# Altium project epsv2.PrjPCB
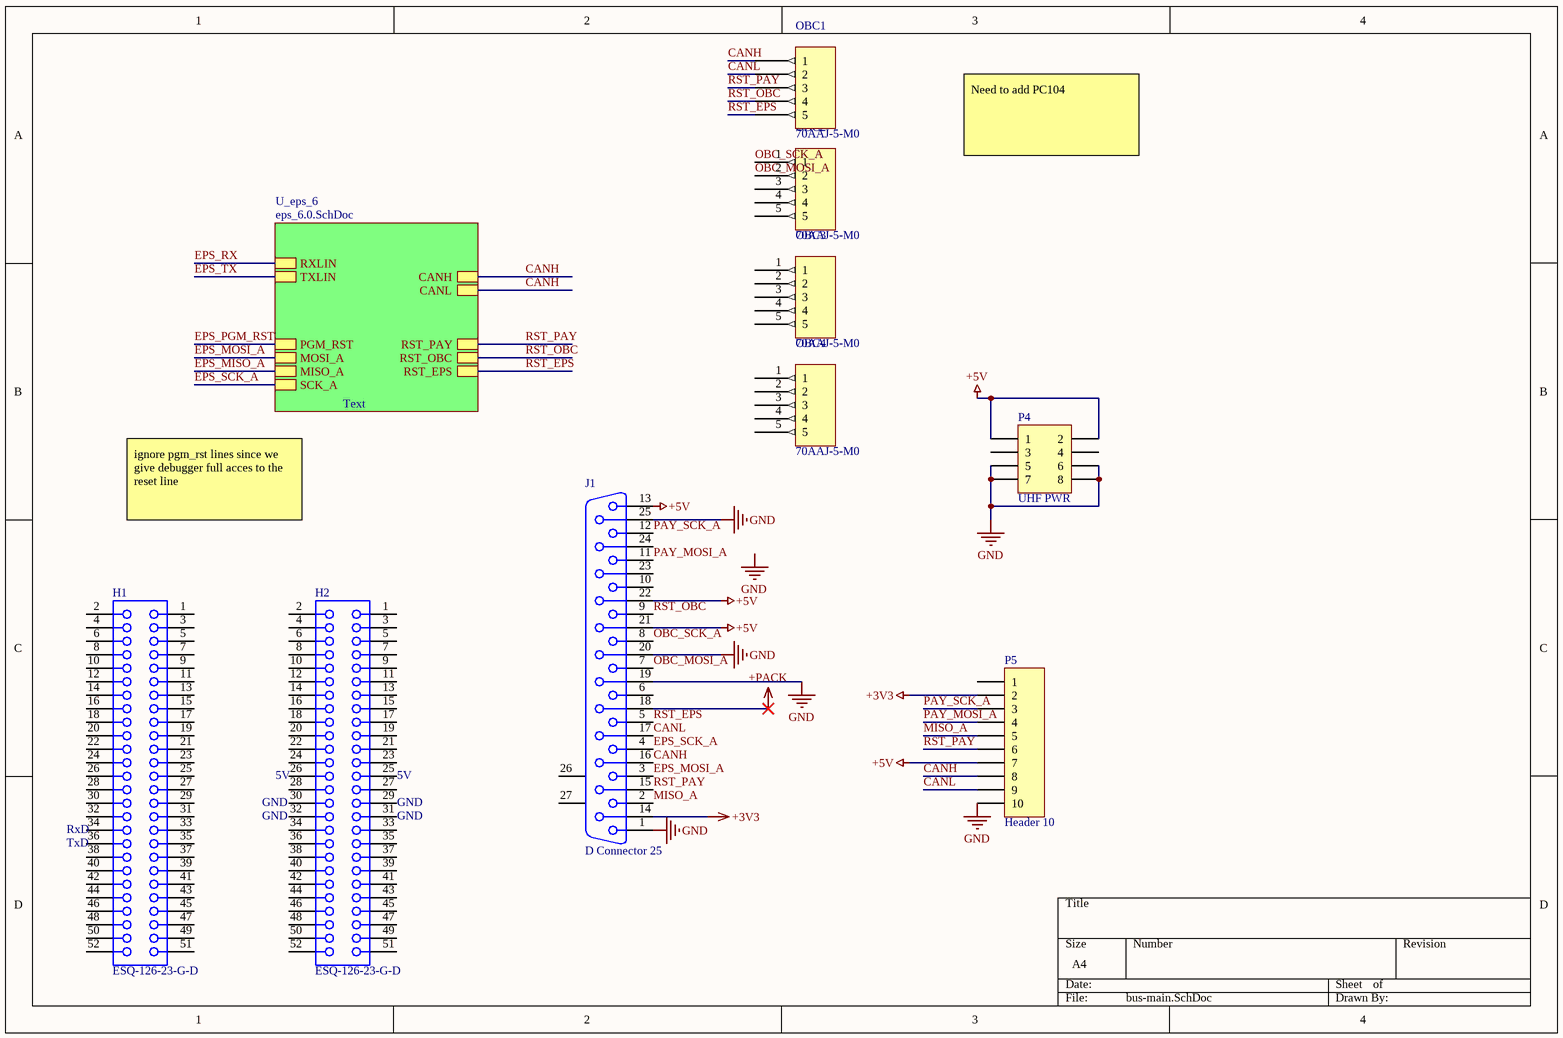
[diagram p0: bus-main.SchDoc]
5 sheets, 64 parts. Net scope: hierarchical (ports join the sheet entries above them; power ports are global).
Board file: eps.PcbDoc
Sheets:
  bus-main.SchDoc
    U_eps_6 = eps_6.0.SchDoc
      U_eps_bt11 = eps_bt1.SchDoc
      U_eps_bt12 = eps_bt1.SchDoc
      U_eps_batt = eps_batt.SchDoc
      Designator = bt_current_monitor.SchDoc

## Sheet bus-main.SchDoc
size A4

### Parts
H1  ESQ-126-23-G-D  [SMTC-ESQ-126-23-X-D]
H2  ESQ-126-23-G-D  [SMTC-ESQ-126-23-X-D]
J1  D Connector 25  [Mini DSub Connector]
OBC1  70AAJ-5-M0
OBC2  70AAJ-5-M0
OBC3  70AAJ-5-M0
OBC4  70AAJ-5-M0
P4  UHF PWR  [HDR2X4]
P5  Header 10  [DF14-10P-1.25H(55) - duplicate]

### Sub-sheets
U_eps_6 = eps_6.0.SchDoc: RXLIN, TXLIN, RST_PAY, RST_OBC, RST_EPS, SCK_A, PGM_RST, MOSI_A, MISO_A, CANL, CANH

### Nets
+3V3: J1.14 P5.2
+5V: J1.13 J1.21 J1.22 P4.1 P4.2 P5.7
+PACK: J1.18
GND: J1.1 J1.19 J1.20 J1.25 P4.5 P4.6 P4.7 P4.8 P5.10
CANH: J1.16 OBC1.1 P5.8 ; sheet U_eps_6/CANL, sheet U_eps_6/CANH
CANL: J1.17 OBC1.2 P5.9
EPS_MISO_A: sheet U_eps_6/MISO_A
EPS_MOSI_A: J1.3 ; sheet U_eps_6/MOSI_A
EPS_PGM_RST: sheet U_eps_6/PGM_RST
EPS_RX: sheet U_eps_6/RXLIN
EPS_SCK_A: J1.4 ; sheet U_eps_6/SCK_A
EPS_TX: sheet U_eps_6/TXLIN
MISO_A: J1.2 P5.5
OBC_MOSI_A: J1.7 OBC2.2
OBC_SCK_A: J1.8 OBC2.1
PAY_MOSI_A: J1.11 P5.4
PAY_SCK_A: J1.12 P5.3
RST_EPS: J1.5 OBC1.5 ; sheet U_eps_6/RST_EPS
RST_OBC: J1.9 OBC1.4 ; sheet U_eps_6/RST_OBC
RST_PAY: J1.15 OBC1.3 P5.6 ; sheet U_eps_6/RST_PAY

Not connected (* = marked no-connect by the designer): H1 1 2 3 4 5 6 7 8 9 10 11 12 13 14 15 16 17 18 19 20 21 22 23 24 25 26 27 28 29 30 31 32 33 34 35 36 37 38 39 40 41 42 43 44 45 46 47 48 49 50 51 52; H2 1 2 3 4 5 6 7 8 9 10 11 12 13 14 15 16 17 18 19 20 21 22 23 24 25 26 27 28 29 30 31 32 33 34 35 36 37 38 39 40 41 42 43 44 45 46 47 48 49 50 51 52; J1 6 10 23 24 26(MH1) 27(MH2); OBC2 3 4 5; OBC3 1 2 3 4 5; OBC4 1 2 3 4 5; P4 3 4; P5 1

### Notes on the sheet
- Need to add PC104
- Text
- ignore pgm_rst lines since we give debugger full acces to the reset line
- (near H2) 5V
- (near H1) RxD
- (near H1) TxD
- (near H2) GND
- Labels drawn without touching a wire or pin: GND

### Library data of the parts
H1 H2 = ESQ-126-23-G-D: PC/104(TM) Elevated Socket Strip, Through-hole, Vertical, -55 to 125 degC, 2.54 mm Pitch, 52-Pin, Female, RoHS; Manufacturer: Samtec; Pitch: 2.54 mm; DatasheetVersion: F-214; PackageVersion: BZ, 9/1998; PackageReference: ESQ-126-23-X-D; PackageDescription: ESQ Strip ASM; Supplier 1: Newark; Supplier Part Number 1: 92P1348; Orientation: Vertical; RoHS: True; Temperature Range: -55 to 125 degC; Mounting Technology: Through-hole; PartNumber: ESQ-126-23-G-D; ComponentLink1Description: Manufacturer URL; ComponentLink1URL: http://www.samtec.com; ComponentLink2Description: Datasheet; ComponentLink2URL: http://www.samtec.com/documents/webfiles/pdf/ESQ_TH.PDF; ComponentLink3Description: Package Specification; ComponentLink3URL: http://www.samtec.com/documents/webfiles/cpdf/ESQ-1XX-XX-X-X-XXX-XX-X-XX-MKT.pdf
J1 = D Connector 25: Receptacle Assembly, 25 Position, Right Angle; PackageDocument: U; Positions: 25; Published: 15-Jun-2001; LatestRevisionDate: 17-Jul-2002; LatestRevisionNote: Re-released for DXP Platform.; DatasheetDocument: 19-Mar-1999; PackageReference: 787202; Publisher: Altium Limited; Orientation: Right Angle; Gender: Receptacle; ComponentLink1Description: Mini-D25 - Molex, LLC 0836149012; ComponentLink1URL: https://www.digikey.ca/product-detail/en/molex-llc/0836149012/WM2144-ND/1867000
P4 = Header 4X2: Header, 4-Pin, Dual row; LatestRevisionDate: 17-Jul-2002; LatestRevisionNote: Re-released for DXP Platform.; Publisher: Altium Limited
P5 = Header 10: Header, 10-Pin; LatestRevisionDate: 17-Jul-2002; LatestRevisionNote: Re-released for DXP Platform.; Publisher: Altium Limited

## Sheet eps_6.0.SchDoc
size A
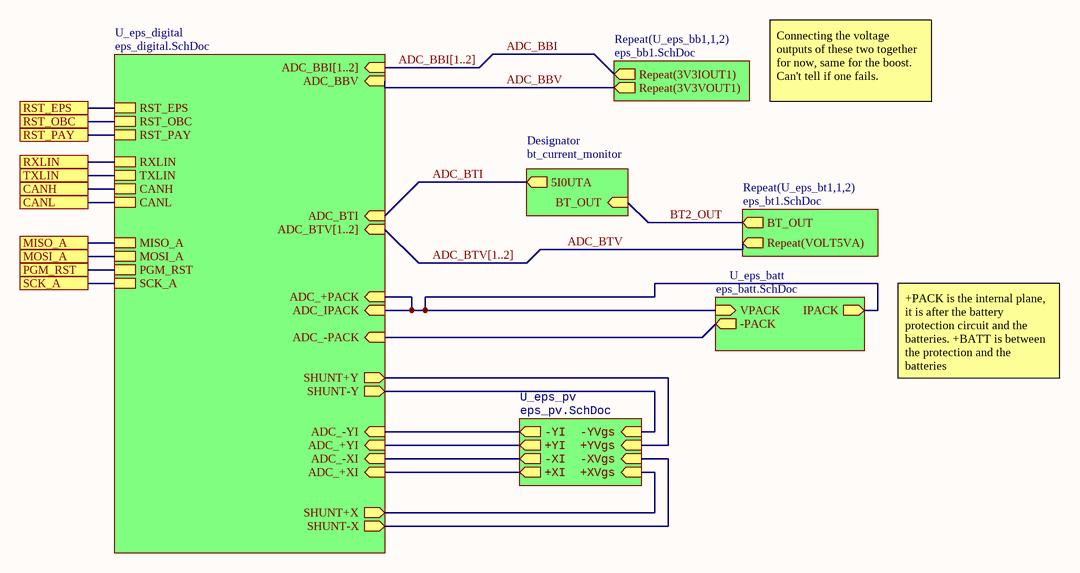
[diagram p1: eps_6.0.SchDoc]

### Sub-sheets
Designator = bt_current_monitor: 5I0UTA (out), BT_OUT (in)
Repeat(U_eps_bb1,1,2) = eps_bb1.SchDoc (file not in this document): Repeat(3V3IOUT1) (out), Repeat(3V3VOUT1) (out)
Repeat(U_eps_bt1,1,2) = eps_bt1.SchDoc: Repeat(VOLT5VA) (out), BT_OUT (out)
U_eps_batt = eps_batt.SchDoc: IPACK (out), VPACK (in), -PACK (out)
U_eps_digital = eps_digital.SchDoc (file not in this document): RST_EPS, RST_OBC, RST_PAY, RXLIN, TXLIN, CANH, CANL, MISO_A, MOSI_A, PGM_RST, SCK_A, ADC_BTV[1..2] (in), ADC_BTI (in), ADC_-PACK (in), ADC_BBI[1..2] (in), ADC_+XI (in), ADC_-XI (in), ADC_+YI (in), ADC_+PACK (in), ADC_-YI (in), SHUNT-Y (out), SHUNT+Y (out), ADC_BBV (in), SHUNT-X (out), SHUNT+X (out), ADC_IPACK (in)
U_eps_pv = eps_pv.SchDoc (file not in this document): +YI (out), -YI (out), -YVgs (in), +XI (out), +YVgs (in), +XVgs (in), -XVgs (in), -XI (out)

### Ports
CANH, CANL, MISO_A, MOSI_A, PGM_RST, RST_EPS, RST_OBC, RST_PAY, RXLIN, SCK_A, TXLIN

### Nets
-PACK: sheet U_eps_digital/ADC_-PACK, sheet U_eps_batt/-PACK
ADC_BBI: sheet Repeat(U_eps_bb1,1,2)/Repeat(3V3IOUT1)
ADC_BBV: sheet U_eps_digital/ADC_BBV, sheet Repeat(U_eps_bb1,1,2)/Repeat(3V3VOUT1)
ADC_BTI: sheet U_eps_digital/ADC_BTI, sheet Designator/5I0UTA
ADC_BTV: sheet Repeat(U_eps_bt1,1,2)/Repeat(VOLT5VA)
BT2_OUT: sheet Repeat(U_eps_bt1,1,2)/BT_OUT, sheet Designator/BT_OUT
CANH: port CANH, port CANL, sheet U_eps_digital/CANH, sheet U_eps_digital/CANL
EPS_MISO_A: port MISO_A, sheet U_eps_digital/MISO_A
EPS_MOSI_A: port MOSI_A, sheet U_eps_digital/MOSI_A
EPS_PGM_RST: port PGM_RST, sheet U_eps_digital/PGM_RST
EPS_RX: port RXLIN, sheet U_eps_digital/RXLIN
EPS_SCK_A: port SCK_A, sheet U_eps_digital/SCK_A
EPS_TX: port TXLIN, sheet U_eps_digital/TXLIN
IPACK: sheet U_eps_digital/ADC_+PACK, sheet U_eps_digital/ADC_IPACK, sheet U_eps_batt/IPACK, sheet U_eps_batt/VPACK
RST_EPS: port RST_EPS, sheet U_eps_digital/RST_EPS
RST_OBC: port RST_OBC, sheet U_eps_digital/RST_OBC
RST_PAY: port RST_PAY, sheet U_eps_digital/RST_PAY
(unnamed): sheet U_eps_digital/ADC_+XI, sheet U_eps_pv/+XI
(unnamed): sheet U_eps_digital/ADC_-XI, sheet U_eps_pv/-XI
(unnamed): sheet U_eps_digital/ADC_+YI, sheet U_eps_pv/+YI
(unnamed): sheet U_eps_digital/ADC_-YI, sheet U_eps_pv/-YI
(unnamed): sheet U_eps_digital/SHUNT-Y, sheet U_eps_pv/-YVgs
(unnamed): sheet U_eps_digital/SHUNT+Y, sheet U_eps_pv/+YVgs
(unnamed): sheet U_eps_digital/SHUNT-X, sheet U_eps_pv/-XVgs
(unnamed): sheet U_eps_digital/SHUNT+X, sheet U_eps_pv/+XVgs

### Buses and harness runs
bus ADC_BBI[1..2] = sheet U_eps_digital/ADC_BBI[1..2]
bus ADC_BTV[1..2] = sheet U_eps_digital/ADC_BTV[1..2]

### Notes on the sheet
- Connecting the voltage outputs of these two together for now, same for the boost. Can't tell if one fails.
- +PACK is the internal plane, it is after the battery protection circuit and the batteries. +BATT is between the protection and the batteries

## Sheet eps_bt1.SchDoc
size A
Used 2 times, as channels U_eps_6/U_eps_bt11, U_eps_6/U_eps_bt12. Parts and nets are listed once, with the designators drawn on the sheet.
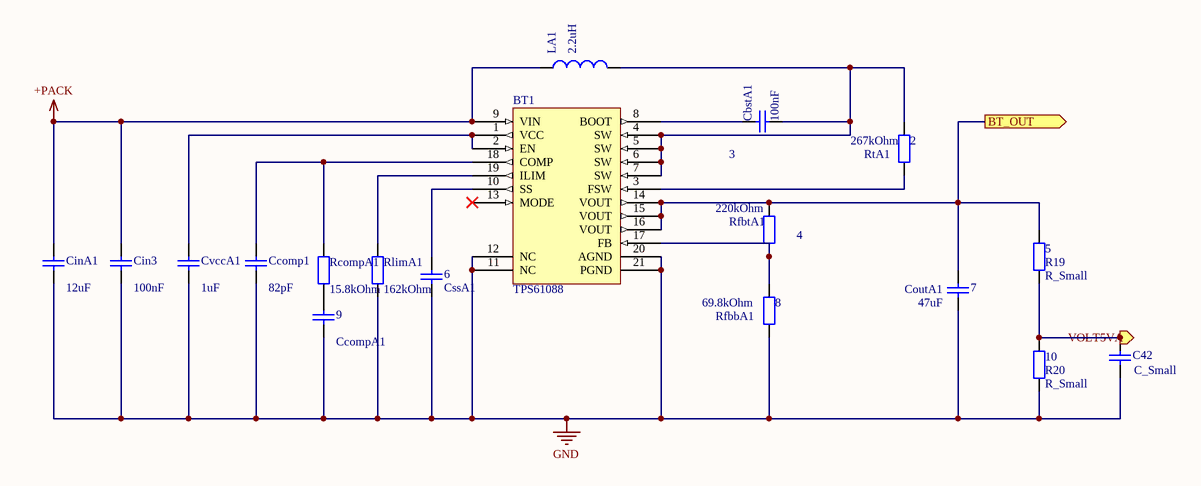
[diagram p2: eps_bt1.SchDoc]

### Parts
2  RtA1  value 267kOhm  [1608[0603]]
3  CbstA1  value 100nF  [1608[0603]]
4  RfbtA1  value 220kOhm  [1608[0603]]
5  R19  value R_Small  [1608[0603]]
6  CssA1  [1608[0603]]
7  CoutA1  value 47uF  [1608[0603]]
8  RfbbA1  value 69.8kOhm  [1608[0603]]
9  value CcompA1  [1608[0603]]
10  R20  value R_Small  [1608[0603]]
BT1  TPS61088  [QFN50P450X350X100-21N]
C42  value C_Small  [1608[0603]]
Ccomp1  value 82pF  [1608[0603]]
Cin3  value 100nF  [1608[0603]]
CinA1  value 12uF  [1608[0603]]
CvccA1  value 1uF  [1608[0603]]
LA1  value 2.2uH  [1608[0603]]
RcompA1  value 15.8kOhm  [1608[0603]]
RlimA1  value 162kOhm  [1608[0603]]

### Ports
BT_OUT (out), VOLT5VA (out)

### Nets
+PACK: BT1.9(VIN) Cin3.2 CinA1.2 LA1.1
GND: 6.1 7.1 8.1 9.1 10.1 BT1.11(NC) BT1.12(NC) BT1.20(AGND) BT1.21(PGND) C42.2 Ccomp1.1 Cin3.1 CinA1.1 CvccA1.1 RlimA1.1
BT_OUT: 4.2 5.2 7.2 BT1.14(VOUT) BT1.15(VOUT) BT1.16(VOUT) ; port BT_OUT
VOLT5VA: 5.1 10.2 C42.1 ; port VOLT5VA
Net2_1: 2.1 3.1 BT1.4(SW) BT1.5(SW) BT1.6(SW) BT1.7(SW) LA1.2
Net2_2: 2.2 BT1.3(FSW)
Net3_2: 3.2 BT1.8(BOOT)
Net4_1: 4.1 8.2 BT1.17(FB)
Net6_2: 6.2 BT1.10(SS)
Net9_2: 9.2 RcompA1.1
NetBT1_1: BT1.1(VCC) BT1.2(EN) CvccA1.2
NetBT1_18: BT1.18(COMP) Ccomp1.2 RcompA1.2
NetBT1_19: BT1.19(ILIM) RlimA1.2

Not connected (* = marked no-connect by the designer): BT1 13(MODE)*

### Channels
U_eps_6/U_eps_bt11: designators end in _U_eps_bt11; ports BT_OUT=BT2_OUT VOLT5VA=ADC_BTV1
U_eps_6/U_eps_bt12: designators end in _U_eps_bt12; ports BT_OUT=BT2_OUT VOLT5VA=ADC_BTV2

### Library data of the parts
2 4 5 8 10 RcompA1 RlimA1 = Res2: Resistor; Published: 8-Jun-2000; LatestRevisionDate: 17-Jul-2002; LatestRevisionNote: Re-released for DXP Platform.; PackageReference: AXIAL-0.4; Publisher: Altium Limited; PackageDescription: Axial Device, Thru-Hole; 2 Leads; 0.4 in Pin Spacing
3 6 7 9 C42 Ccomp1 Cin3 CinA1 CvccA1 = Cap: Capacitor; Published: 8-Jun-2000; LatestRevisionDate: 17-Jul-2002; LatestRevisionNote: Re-released for DXP Platform.; PackageReference: RAD-0.3; Publisher: Altium Limited; PackageDescription: Radial Cap, Thru-Hole; 2 Leads; 0.3 in Pin Spacing
BT1 = TPS61088: Boost converter
LA1 = Inductor: Code_IEC: 1005; Published: 8-Jun-2000; LatestRevisionDate: 29-May-2009; LatestRevisionNote: IPC-7351 Footprint Added.; PackageReference: 0402-A; Publisher: Altium Limited; PackageDescription: Chip Inductor; Code_JEITA: 0402

## Sheet eps_batt.SchDoc
size A4
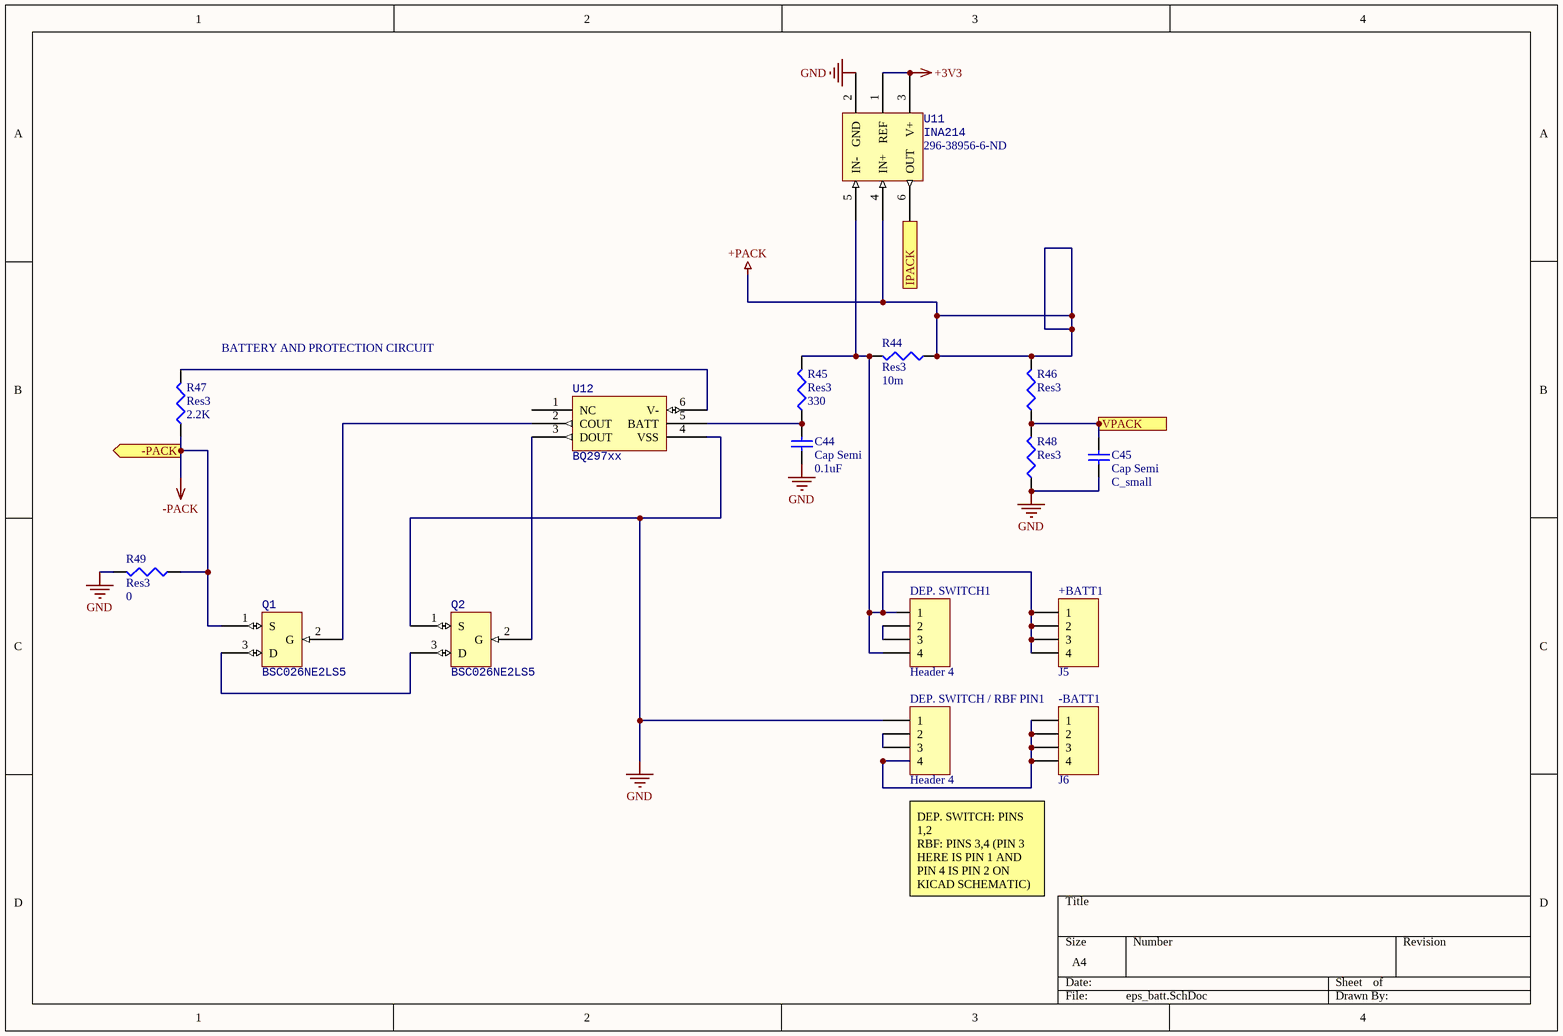
[diagram p3: eps_batt.SchDoc]

### Parts
+BATT1  J5  [DF14-4P-1.25H(55)]
-BATT1  J6  [DF14-4P-1.25H(55)]
C44  Cap Semi  value 0.1uF  [1608[0603]]
C45  Cap Semi  value C_small  [1608[0603]]
DEP._SWITCH1  Header 4  [DF14-4P-1.25H(55)]
DEP._SWITCH_/_RBF_PIN1  Header 4  [DF14-4P-1.25H(55)]
Q1  BSC026NE2LS5  [INF-PG-TDSON-8-1_V]
Q2  BSC026NE2LS5  [INF-PG-TDSON-8-1_V]
R44  Res3  value 10m  [J1-0603]
R45  Res3  value 330  [J1-0603]
R46  Res3  [J1-0603]
R47  Res3  value 2.2K  [J1-0603]
R48  Res3  [J1-0603]
R49  Res3  value 0  [J1-0603]
U11  INA214  Supplier Part Number 1: 296-38956-6-ND  [SOT65P210X110-6N]
U12  BQ297xx  [SON50P150X150X80-6N - duplicate1]

### Ports
-PACK (out), IPACK (out), VPACK (in)

### Nets
+3V3: U11.1(REF) U11.3(V+)
+PACK: R44.1 R46.2 U11.4(IN+)
-PACK: Q1.1(S) R47.1 R49.1 ; port -PACK
GND: C44.1 C45.1 DEP._SWITCH_/_RBF_PIN1.1 Q2.1(S) R48.1 R49.2 U11.2(GND) U12.4(VSS)
IPACK: C45.2 R46.1 R48.2 U11.6(OUT) ; port IPACK, port VPACK
Net+BATT1_1: +BATT1.1 +BATT1.2 +BATT1.3 +BATT1.4 DEP._SWITCH1.1 DEP._SWITCH1.4 R44.2 R45.2 U11.5(IN-)
Net-BATT1_1: -BATT1.1 -BATT1.2 -BATT1.3 -BATT1.4 DEP._SWITCH_/_RBF_PIN1.4
NetC44_2: C44.2 R45.1 U12.5(BATT)
NetDEP._SWITCH1_2: DEP._SWITCH1.2 DEP._SWITCH1.3
NetDEP._SWITCH_/_RBF_PIN1_2: DEP._SWITCH_/_RBF_PIN1.2 DEP._SWITCH_/_RBF_PIN1.3
NetQ1_2: Q1.2(G) U12.2(COUT)
NetQ1_3: Q1.3(D) Q2.3(D)
NetQ2_2: Q2.2(G) U12.3(DOUT)
NetR47_2: R47.2 U12.6(V-)

Not connected (* = marked no-connect by the designer): U12 1(NC)

### Notes on the sheet
- (near R47) BATTERY AND PROTECTION CIRCUIT
- DEP. SWITCH: PINS 1,2
  RBF: PINS 3,4 (PIN 3 HERE IS PIN 1 AND PIN 4 IS PIN 2 ON KICAD SCHEMATIC)

### Library data of the parts
+BATT1 -BATT1 DEP._SWITCH1 DEP._SWITCH_/_RBF_PIN1 = Header 4: Header, 4-Pin; LatestRevisionDate: 17-Jul-2002; LatestRevisionNote: Re-released for DXP Platform.; Publisher: Altium Limited; ComponentLink1Description: Hirose DF14-4P-1.25H(55) Right Angle; ComponentLink1URL: https://www.digikey.ca/product-detail/en/hirose-electric-co-ltd/DF14-4P-1.25H-55/H10317-ND/964472
C44 C45 = Cap Semi: Capacitor (Semiconductor SIM Model); Published: 8-Jun-2000; LatestRevisionDate: 29-May-2009; LatestRevisionNote: IPC-7351 Footprint Added.; PackageReference: C1206; Publisher: Altium Limited; PackageDescription: Chip Capacitor
Q1 Q2 = BSC026NE2LS5: MOSFET; ComponentLink1Description: N-Channel Mosfet; ComponentLink1URL: https://www.digikey.ca/product-detail/en/infineon-technologies/BSC026NE2LS5ATMA1/BSC026NE2LS5ATMA1DKR-ND/6564538
R44-R49 = Res3: Resistor; Published: 8-Jun-2000; LatestRevisionDate: 29-May-2009; LatestRevisionNote: IPC-7351 Footprint Added.; PackageReference: J1-0603; Publisher: Altium Limited; PackageDescription: Chip Resistor
U11 = INA214: Current monitor; Supplier 1: Digi-Key; ComponentLink1Description: IC Current Monitor; ComponentLink1URL: https://www.digikey.ca/product-detail/en/texas-instruments/INA214AIDCKR/296-38956-1-ND/5143051
U12 = BQ2972: Battery protection; ComponentLink1Description: Charge Controller; ComponentLink1URL: https://www.digikey.com/product-detail/en/texas-instruments/BQ29729DSET/296-44131-1-ND/6005144

## Sheet bt_current_monitor.SchDoc
size A4
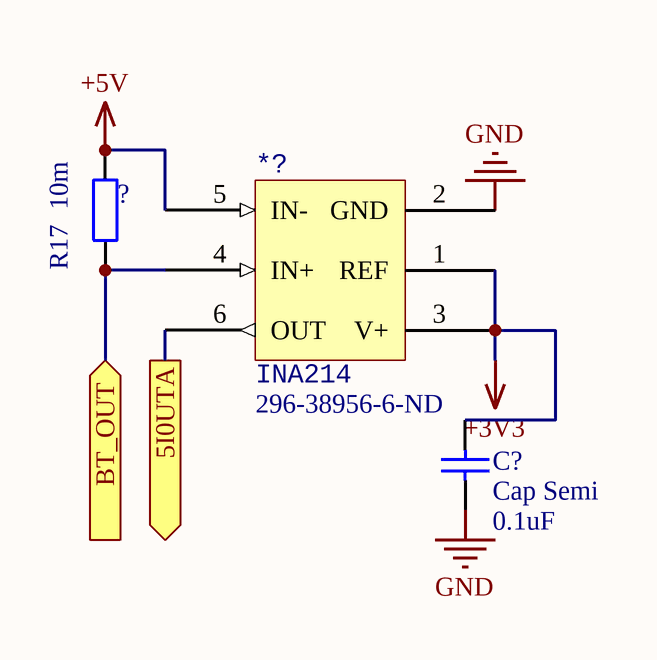
[diagram p4: bt_current_monitor.SchDoc]

### Parts
*?  INA214  Supplier Part Number 1: 296-38956-6-ND  [SOT65P210X110-6N]
?  R17  value 10m  [1608[0603]]
C?  Cap Semi  value 0.1uF  [1608[0603]]

### Ports
5I0UTA (out), BT_OUT (in)

### Nets
+3V3: *?.1(REF) *?.3(V+) C?.2
+5V: *?.5(IN-) ?.2
GND: *?.2(GND) C?.1
ADC_BTI: *?.6(OUT) ; port 5I0UTA
BT2_OUT: *?.4(IN+) ?.1 ; port BT_OUT

### Library data of the parts
*? = INA214: Current monitor; Supplier 1: Digi-Key
? = Res2: Resistor; Published: 8-Jun-2000; LatestRevisionDate: 17-Jul-2002; LatestRevisionNote: Re-released for DXP Platform.; PackageReference: AXIAL-0.4; Publisher: Altium Limited; PackageDescription: Axial Device, Thru-Hole; 2 Leads; 0.4 in Pin Spacing
C? = Cap Semi: Capacitor (Semiconductor SIM Model); Published: 8-Jun-2000; LatestRevisionDate: 29-May-2009; LatestRevisionNote: IPC-7351 Footprint Added.; PackageReference: C1206; Publisher: Altium Limited; PackageDescription: Chip Capacitor

## Nets that join several sheets
+3V3: bus-main (J1.14 P5.2), eps_batt (U11.1 U11.3), bt_current_monitor (*?.1 *?.3 C?.2)
+5V: bus-main (6 pins), bt_current_monitor (*?.5 ?.2)
+PACK: bus-main (J1.18), U_eps_6/U_eps_bt11 (BT1_U_eps_bt11.9 Cin3_U_eps_bt11.2 CinA1_U_eps_bt11.2 LA1_U_eps_bt11.1), U_eps_6/U_eps_bt12 (BT1_U_eps_bt12.9 Cin3_U_eps_bt12.2 CinA1_U_eps_bt12.2 LA1_U_eps_bt12.1), eps_batt (R44.1 R46.2 U11.4)
GND: bus-main (9 pins), U_eps_6/U_eps_bt11 (15 pins), U_eps_6/U_eps_bt12 (15 pins), eps_batt (8 pins), bt_current_monitor (*?.2 C?.1)
BT2_OUT: U_eps_6/U_eps_bt11 (6 pins), U_eps_6/U_eps_bt12 (6 pins), bt_current_monitor (*?.4 ?.1)